# Altium project DiAoPu.PrjPcb
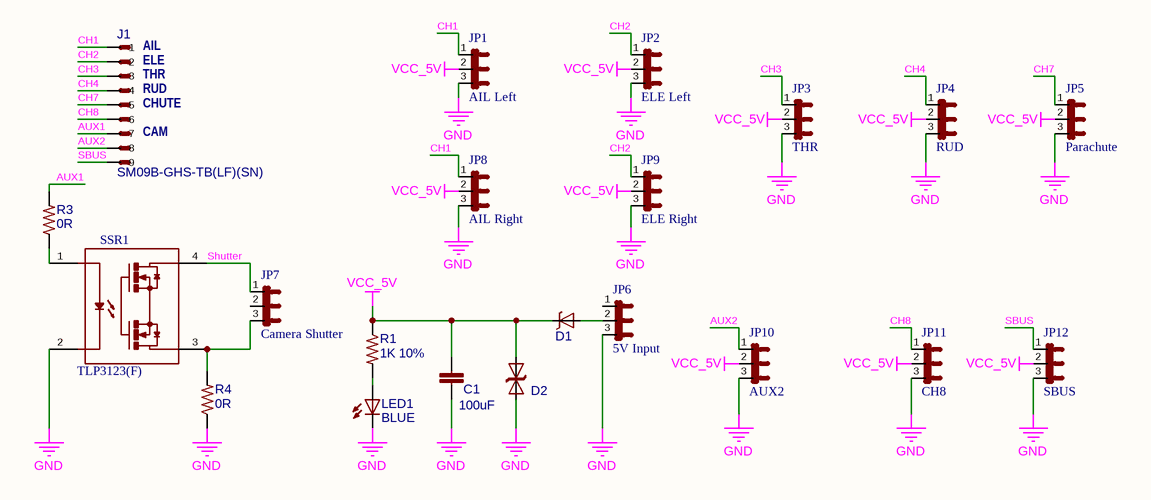
[diagram p0: DiAoPu.SchDoc]
1 sheet, 21 parts. Net scope: global (net labels, ports and power ports of the same name join across sheets).
Board files: DiAoPu.PcbDoc, DiAoPu_Array.PcbDoc

## Sheet DiAoPu.SchDoc
size A4

### Parts
C1  100uF  [1210-CAP]
D1  Schottky barrier diode in DO214AC, e.g. Fairchild SS14.  [DO-214AA]  (value not drawn)
D2  DIODE-Bi−Directional TVS  [DO-214AA]  (value not drawn)
J1  SM09B-GHS-TB(LF)(SN)  [SM09B-GHS-TB(LF)]
JP1  AIL Left  [SJ_3 2MM Pitch]
JP2  ELE Left  [SJ_3 2MM Pitch]
JP3  THR  [SJ_3 2MM Pitch]
JP4  RUD  [SJ_3 2MM Pitch]
JP5  Parachute  [SJ_3 2MM Pitch]
JP6  5V Input  [SJ_3 2MM Pitch]
JP7  Camera Shutter  [SJ_3 2MM Pitch]
JP8  AIL Right  [SJ_3 2MM Pitch]
JP9  ELE Right  [SJ_3 2MM Pitch]
JP10  AUX2  [SJ_3 2MM Pitch]
JP11  CH8  [SJ_3 2MM Pitch]
JP12  SBUS  [SJ_3 2MM Pitch]
LED1  value BLUE  [0603-LED]  (hidden comment: <b>LEDs</b> / Standard schematic elements and footprints for 5mm, 3mm, 1206, and 0603 sized LEDs. 5mm - Spark Fun Electronics SKU : COM-00529 (and others))
R1  value 1K 10%  [0603-RES]  (hidden comment: <b>Resistor</b> / Basic schematic elements and footprints for 0603, 1206, and PTH 1/10th watt (small) resistors.)
R3  0R  [0603-RES]
R4  0R  [0603-RES]
SSR1  TLP3123(F)  [SOP4-2.54]

### Nets
GND: C1.2 D2.A JP1.3 JP2.3 JP3.3 JP4.3 JP5.3 JP6.3 JP8.3 JP9.3 JP10.3 JP11.3 JP12.3 LED1.C R4.1 SSR1.2
VCC_5V: C1.1 D1.C D2.C JP1.2 JP2.2 JP3.2 JP4.2 JP5.2 JP8.2 JP9.2 JP10.2 JP11.2 JP12.2 R1.1
AUX1: J1.7 R3.2
AUX2: J1.8 JP10.1
CH1: J1.1 JP1.1 JP8.1
CH2: J1.2 JP2.1 JP9.1
CH3: J1.3 JP3.1
CH4: J1.4 JP4.1
CH7: J1.5 JP5.1
CH8: J1.6 JP11.1
SBUS: J1.9 JP12.1
Shutter: JP7.1 SSR1.4
NetD1_A: D1.A JP6.2
NetJP7_3: JP7.3 R4.2 SSR1.3
NetLED1_A: LED1.A R1.2
NetR3_1: R3.1 SSR1.1

Not connected (* = marked no-connect by the designer): JP6 1; JP7 2

### Notes on the sheet
- (near J1) AIL
- (near J1) ELE
- (near J1) THR
- (near J1) RUD
- (near J1) CHUTE
- (near J1) CAM

### Library data of the parts
C1 = CAP0402-CAP: <b>Capacitor</b> / Standard 0603 ceramic capacitor, and 0.1" leaded capacitor.; PARTNO: GRM32ER71H475K; >NAME: C10; >VALUE: 4.7μF/50V/X7R
D1 = DIODE-SCHOTTKY_SMA: VALUE: SS24
D2 = DIODE-Bi−Directional TVS: VALUE: P6SMB36CAT3G
JP1-JP12 = JUMPER-3SMD
LED1 = LED0603
R1 = RESISTOR0603-RES
R3 R4 = RESISTOR0603-RES: VALUE: 10K 5%
SSR1 = TLP3123SO: VALUE: TLP3123(F)
J1 = SM09B-GHS-TB(LF)(SN): VALUE: SM09B-GHS-TB(LF)(SN)